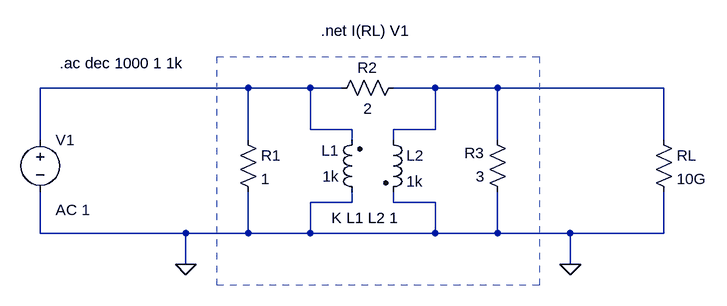
[diagram p0: schematic sim1.asc]
sim1.asc, the LTspice schematic file:
Version 4
SHEET 1 880 680
WIRE 48 48 -272 48
WIRE 144 48 48 48
WIRE 192 48 144 48
WIRE 336 48 272 48
WIRE 432 48 336 48
WIRE 688 48 432 48
WIRE 144 112 144 48
WIRE 208 112 144 112
WIRE 336 112 336 48
WIRE 336 112 272 112
WIRE -272 128 -272 48
WIRE 48 128 48 48
WIRE 208 128 208 112
WIRE 272 128 272 112
WIRE 432 128 432 48
WIRE 688 128 688 48
WIRE 208 224 208 208
WIRE 208 224 144 224
WIRE 272 224 272 208
WIRE 336 224 272 224
WIRE -272 272 -272 208
WIRE -48 272 -272 272
WIRE 48 272 48 208
WIRE 48 272 -48 272
WIRE 144 272 144 224
WIRE 144 272 48 272
WIRE 336 272 336 224
WIRE 336 272 144 272
WIRE 432 272 432 208
WIRE 432 272 336 272
WIRE 544 272 432 272
WIRE 688 272 688 208
WIRE 688 272 544 272
WIRE -48 320 -48 272
WIRE 544 320 544 272
FLAG -48 320 0
FLAG 544 320 0
SYMBOL ind2 224 224 R180
WINDOW 0 36 80 Left 2
WINDOW 3 36 40 Left 2
SYMATTR InstName L1
SYMATTR Value 1k
SYMATTR Type ind
SYMBOL ind2 256 112 R0
SYMATTR InstName L2
SYMATTR Value 1k
SYMATTR Type ind
SYMBOL res 32 112 R0
SYMATTR InstName R1
SYMATTR Value 1
SYMBOL res 288 32 R90
WINDOW 0 0 56 VBottom 2
WINDOW 3 32 56 VTop 2
SYMATTR InstName R2
SYMATTR Value 2
SYMBOL res 448 224 R180
WINDOW 0 36 76 Left 2
WINDOW 3 36 40 Left 2
SYMATTR InstName R3
SYMATTR Value 3
SYMBOL voltage -272 112 R0
WINDOW 123 24 124 Left 2
WINDOW 39 0 0 Left 0
SYMATTR InstName V1
SYMATTR Value ""
SYMATTR Value2 AC 1
SYMBOL res 672 112 R0
SYMATTR InstName RL
SYMATTR Value 10G
TEXT 176 248 Left 2 !K L1 L2 1
TEXT 160 -40 Left 2 !.net I(RL) V1
TEXT -242 10 Left 2 !.ac dec 1000 1 1k
RECTANGLE Normal 496 352 0 0 2

The netlist it stands for:
* sim1.asc
L1 0 N001 1k
L2 N002 0 1k
R1 N001 0 1
R2 N002 N001 2
R3 0 N002 3
V1 N001 0 AC 1
RL N002 0 10G
K L1 L2 1
.net I(RL) V1
.ac dec 1000 1 1k
.backanno
.end